# Altium schematic sheet b2b.SchDoc
size A
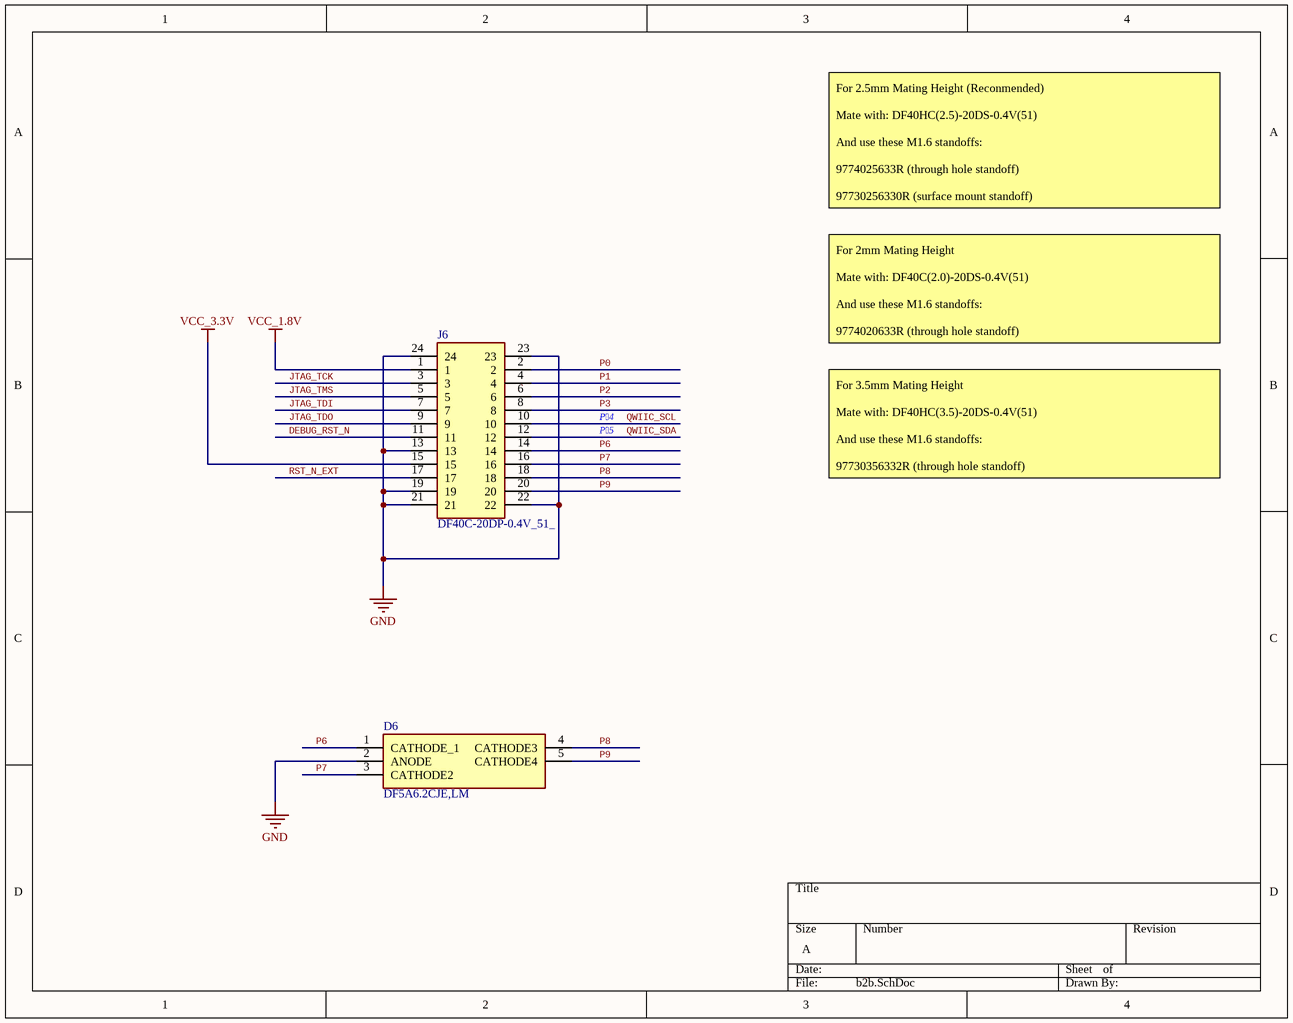
[diagram p0: b2b.SchDoc]

## Parts
D6  DF5A6.2CJE,LM  [SOTFL50P160X60-5N]
J6  DF40C-20DP-0.4V_51_  [DF40C20DP04V51]

## Nets
GND: D6.2(ANODE) J6.13 J6.19 J6.21 J6.22 J6.23 J6.24
VCC_1.8V: J6.1
VCC_3.3V: J6.15
DEBUG_RST_N: J6.11
JTAG_TCK: J6.3
JTAG_TDI: J6.7
JTAG_TDO: J6.9
JTAG_TMS: J6.5
P0: J6.2
P1: J6.4
P2: J6.6
P3: J6.8
P6: D6.1(CATHODE_1) J6.14
P7: D6.3(CATHODE2) J6.16
P8: D6.4(CATHODE3) J6.18
P9: D6.5(CATHODE4) J6.20
QWIIC_SCL: J6.10
QWIIC_SDA: J6.12
RST_N_EXT: J6.17

## Notes on the sheet
- For 2.5mm Mating Height (Reconmended)
  Mate with: DF40HC(2.5)-20DS-0.4V(51)
  And use these M1.6 standoffs:
  9774025633R (through hole standoff)
  97730256330R (surface mount standoff)
- For 2mm Mating Height
  Mate with: DF40C(2.0)-20DS-0.4V(51)
  And use these M1.6 standoffs:
  9774020633R (through hole standoff)
- P4
- P5
- For 3.5mm Mating Height
  Mate with: DF40HC(3.5)-20DS-0.4V(51)
  And use these M1.6 standoffs:
  97730356332R (through hole standoff)
  97730356330R (surface mount standoff)

## Library data of the parts
D6 = DF5A5.6CJE,LM: Diode; Manufacturer_Name: Toshiba; Height: 0.6mm; Manufacturer_Part_Number: DF5A6.2CJE,LM; Mouser Part Number: 757-DF5A6.2CJE,LM; Arrow Part Number: DF5A6.2CJE,LM; MPN: DF5A6.2CJE,LM; Part Number: DF5A6.2CJE,LM
J6 = DF40C-20DP-0.4V_51_: Connector; Manufacturer_Name: Hirose; Manufacturer_Part_Number: DF40C-20DP-0.4V(51); Datasheet Link: https://datasheet.datasheetarchive.com/originals/distributors/Datasheets-DGA17/1059795.pdf; Height: 1.29mm; Mouser Part Number: 798-DF40C20DP0.4V51; Mouser Price/Stock: https://www.mouser.co.uk/ProductDetail/Hirose-Connector/DF40C-20DP-0.4V51?qs=eDUdFcBPps31lPFyZ%252BXRFg%3D%3D; Arrow Part Number: DF40C-20DP-0.4V(51); Arrow Price/Stock: https://www.arrow.com/en/products/df40c-20dp-0.4v-51/hirose-electric; MPN: DF40C-20DP-0.4V(51); Part Number: DF40C-20DP-0.4V(51)